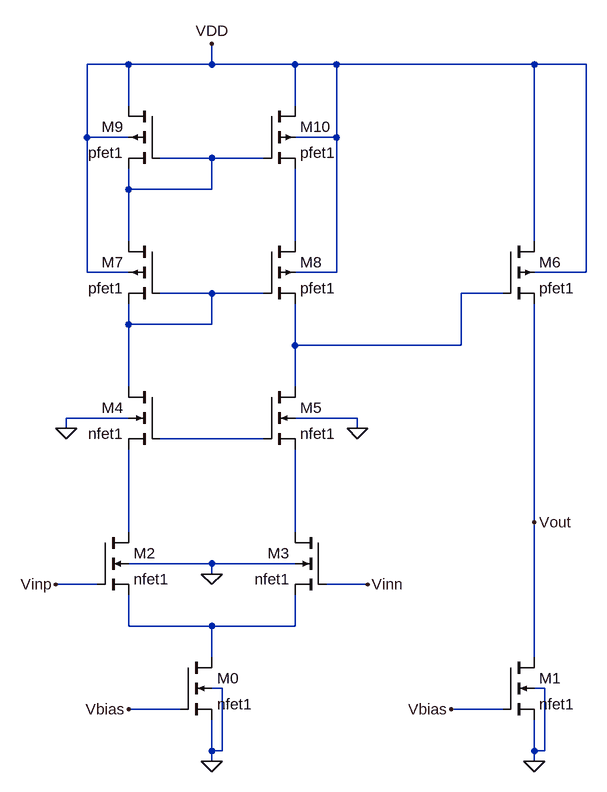
[diagram p0: schematic telescopic_twostage.asc]
telescopic_twostage.asc, the LTspice schematic file:
Version 4
SHEET 1 1092 680
WIRE 336 -656 272 -656
WIRE 464 -656 464 -688
WIRE 464 -656 336 -656
WIRE 592 -656 464 -656
WIRE 656 -656 592 -656
WIRE 960 -656 656 -656
WIRE 1040 -656 960 -656
WIRE 336 -592 336 -656
WIRE 592 -592 592 -656
WIRE 272 -544 272 -656
WIRE 336 -544 272 -544
WIRE 656 -544 656 -656
WIRE 656 -544 592 -544
WIRE 464 -512 384 -512
WIRE 544 -512 464 -512
WIRE 336 -464 336 -496
WIRE 464 -464 464 -512
WIRE 464 -464 336 -464
WIRE 336 -384 336 -464
WIRE 592 -384 592 -496
WIRE 960 -384 960 -656
WIRE 272 -336 272 -544
WIRE 336 -336 272 -336
WIRE 656 -336 656 -544
WIRE 656 -336 592 -336
WIRE 1040 -336 1040 -656
WIRE 1040 -336 960 -336
WIRE 464 -304 384 -304
WIRE 544 -304 464 -304
WIRE 912 -304 848 -304
WIRE 336 -256 336 -288
WIRE 464 -256 464 -304
WIRE 464 -256 336 -256
WIRE 592 -224 592 -288
WIRE 848 -224 848 -304
WIRE 848 -224 592 -224
WIRE 336 -160 336 -256
WIRE 592 -160 592 -224
WIRE 336 -112 240 -112
WIRE 688 -112 592 -112
WIRE 240 -96 240 -112
WIRE 688 -96 688 -112
WIRE 544 -80 384 -80
WIRE 960 48 960 -288
WIRE 336 64 336 -64
WIRE 592 64 592 -64
WIRE 464 112 336 112
WIRE 592 112 464 112
WIRE 464 128 464 112
WIRE 288 144 224 144
WIRE 704 144 640 144
WIRE 336 208 336 160
WIRE 464 208 336 208
WIRE 592 208 592 160
WIRE 592 208 464 208
WIRE 464 256 464 208
WIRE 960 256 960 48
WIRE 480 304 464 304
WIRE 976 304 960 304
WIRE 416 336 336 336
WIRE 912 336 832 336
WIRE 464 400 464 352
WIRE 480 400 480 304
WIRE 480 400 464 400
WIRE 960 400 960 352
WIRE 976 400 976 304
WIRE 976 400 960 400
WIRE 464 416 464 400
WIRE 960 416 960 400
FLAG 464 128 0
FLAG 464 416 0
FLAG 240 -96 0
FLAG 688 -96 0
FLAG 464 -688 VDD
FLAG 224 144 Vinp
FLAG 704 144 Vinn
FLAG 336 336 Vbias
FLAG 960 416 0
FLAG 832 336 Vbias
FLAG 960 48 Vout
SYMBOL nmos4 288 64 R0
SYMATTR InstName M2
SYMATTR Value2 l=1u w=4u
SYMATTR Value nfet1
SYMBOL nmos4 640 64 M0
SYMATTR InstName M3
SYMATTR Value2 l=1u w=4u
SYMATTR Value nfet1
SYMBOL nmos4 384 -160 M0
SYMATTR InstName M4
SYMATTR Value2 l=300n w=4u
SYMATTR Value nfet1
SYMBOL nmos4 544 -160 R0
SYMATTR InstName M5
SYMATTR Value2 l=300n w=4u
SYMATTR Value nfet1
SYMBOL pmos4 544 -384 R0
SYMATTR InstName M8
SYMATTR Value2 l=300n w=8u
SYMATTR Value pfet1
SYMBOL pmos4 384 -384 M0
SYMATTR InstName M7
SYMATTR Value2 l=300n w=8u
SYMATTR Value pfet1
SYMBOL pmos4 384 -592 M0
SYMATTR InstName M9
SYMATTR Value2 l=1u w=8u
SYMATTR Value pfet1
SYMBOL pmos4 544 -592 R0
SYMATTR InstName M10
SYMATTR Value2 l=1u w=8u
SYMATTR Value pfet1
SYMBOL nmos4 416 256 R0
SYMATTR InstName M0
SYMATTR Value2 l=2u w=16u
SYMATTR Value nfet1
SYMBOL pmos4 912 -384 R0
SYMATTR InstName M6
SYMATTR Value2 l=0.5u w=32u
SYMATTR Value pfet1
SYMBOL nmos4 912 256 R0
SYMATTR InstName M1
SYMATTR Value2 l=2u w=128u
SYMATTR Value nfet1

The netlist it stands for:
* telescopic_twostage.asc
M2 N006 Vinp N008 0 nfet1 l=1u w=4u
M3 N007 Vinn N008 0 nfet1 l=1u w=4u
M4 N003 N005 N006 0 nfet1 l=300n w=4u
M5 N004 N005 N007 0 nfet1 l=300n w=4u
M8 N002 N003 N004 VDD pfet1 l=300n w=8u
M7 N001 N003 N003 VDD pfet1 l=300n w=8u
M9 VDD N001 N001 VDD pfet1 l=1u w=8u
M10 VDD N001 N002 VDD pfet1 l=1u w=8u
M0 N008 Vbias 0 0 nfet1 l=2u w=16u
M6 VDD N004 Vout VDD pfet1 l=0.5u w=32u
M1 Vout Vbias 0 0 nfet1 l=2u w=128u
.model NMOS NMOS
.model PMOS PMOS
.lib standard.mos
.backanno
.end